# EasyEDA schematic SmartBinDiagram.json
TITLE: SmartBin; REV: 1.0; Date: 2024-05-15; Sheet: 1/1; Drawn By: stevenleonel22201; Company: Leonel Campos
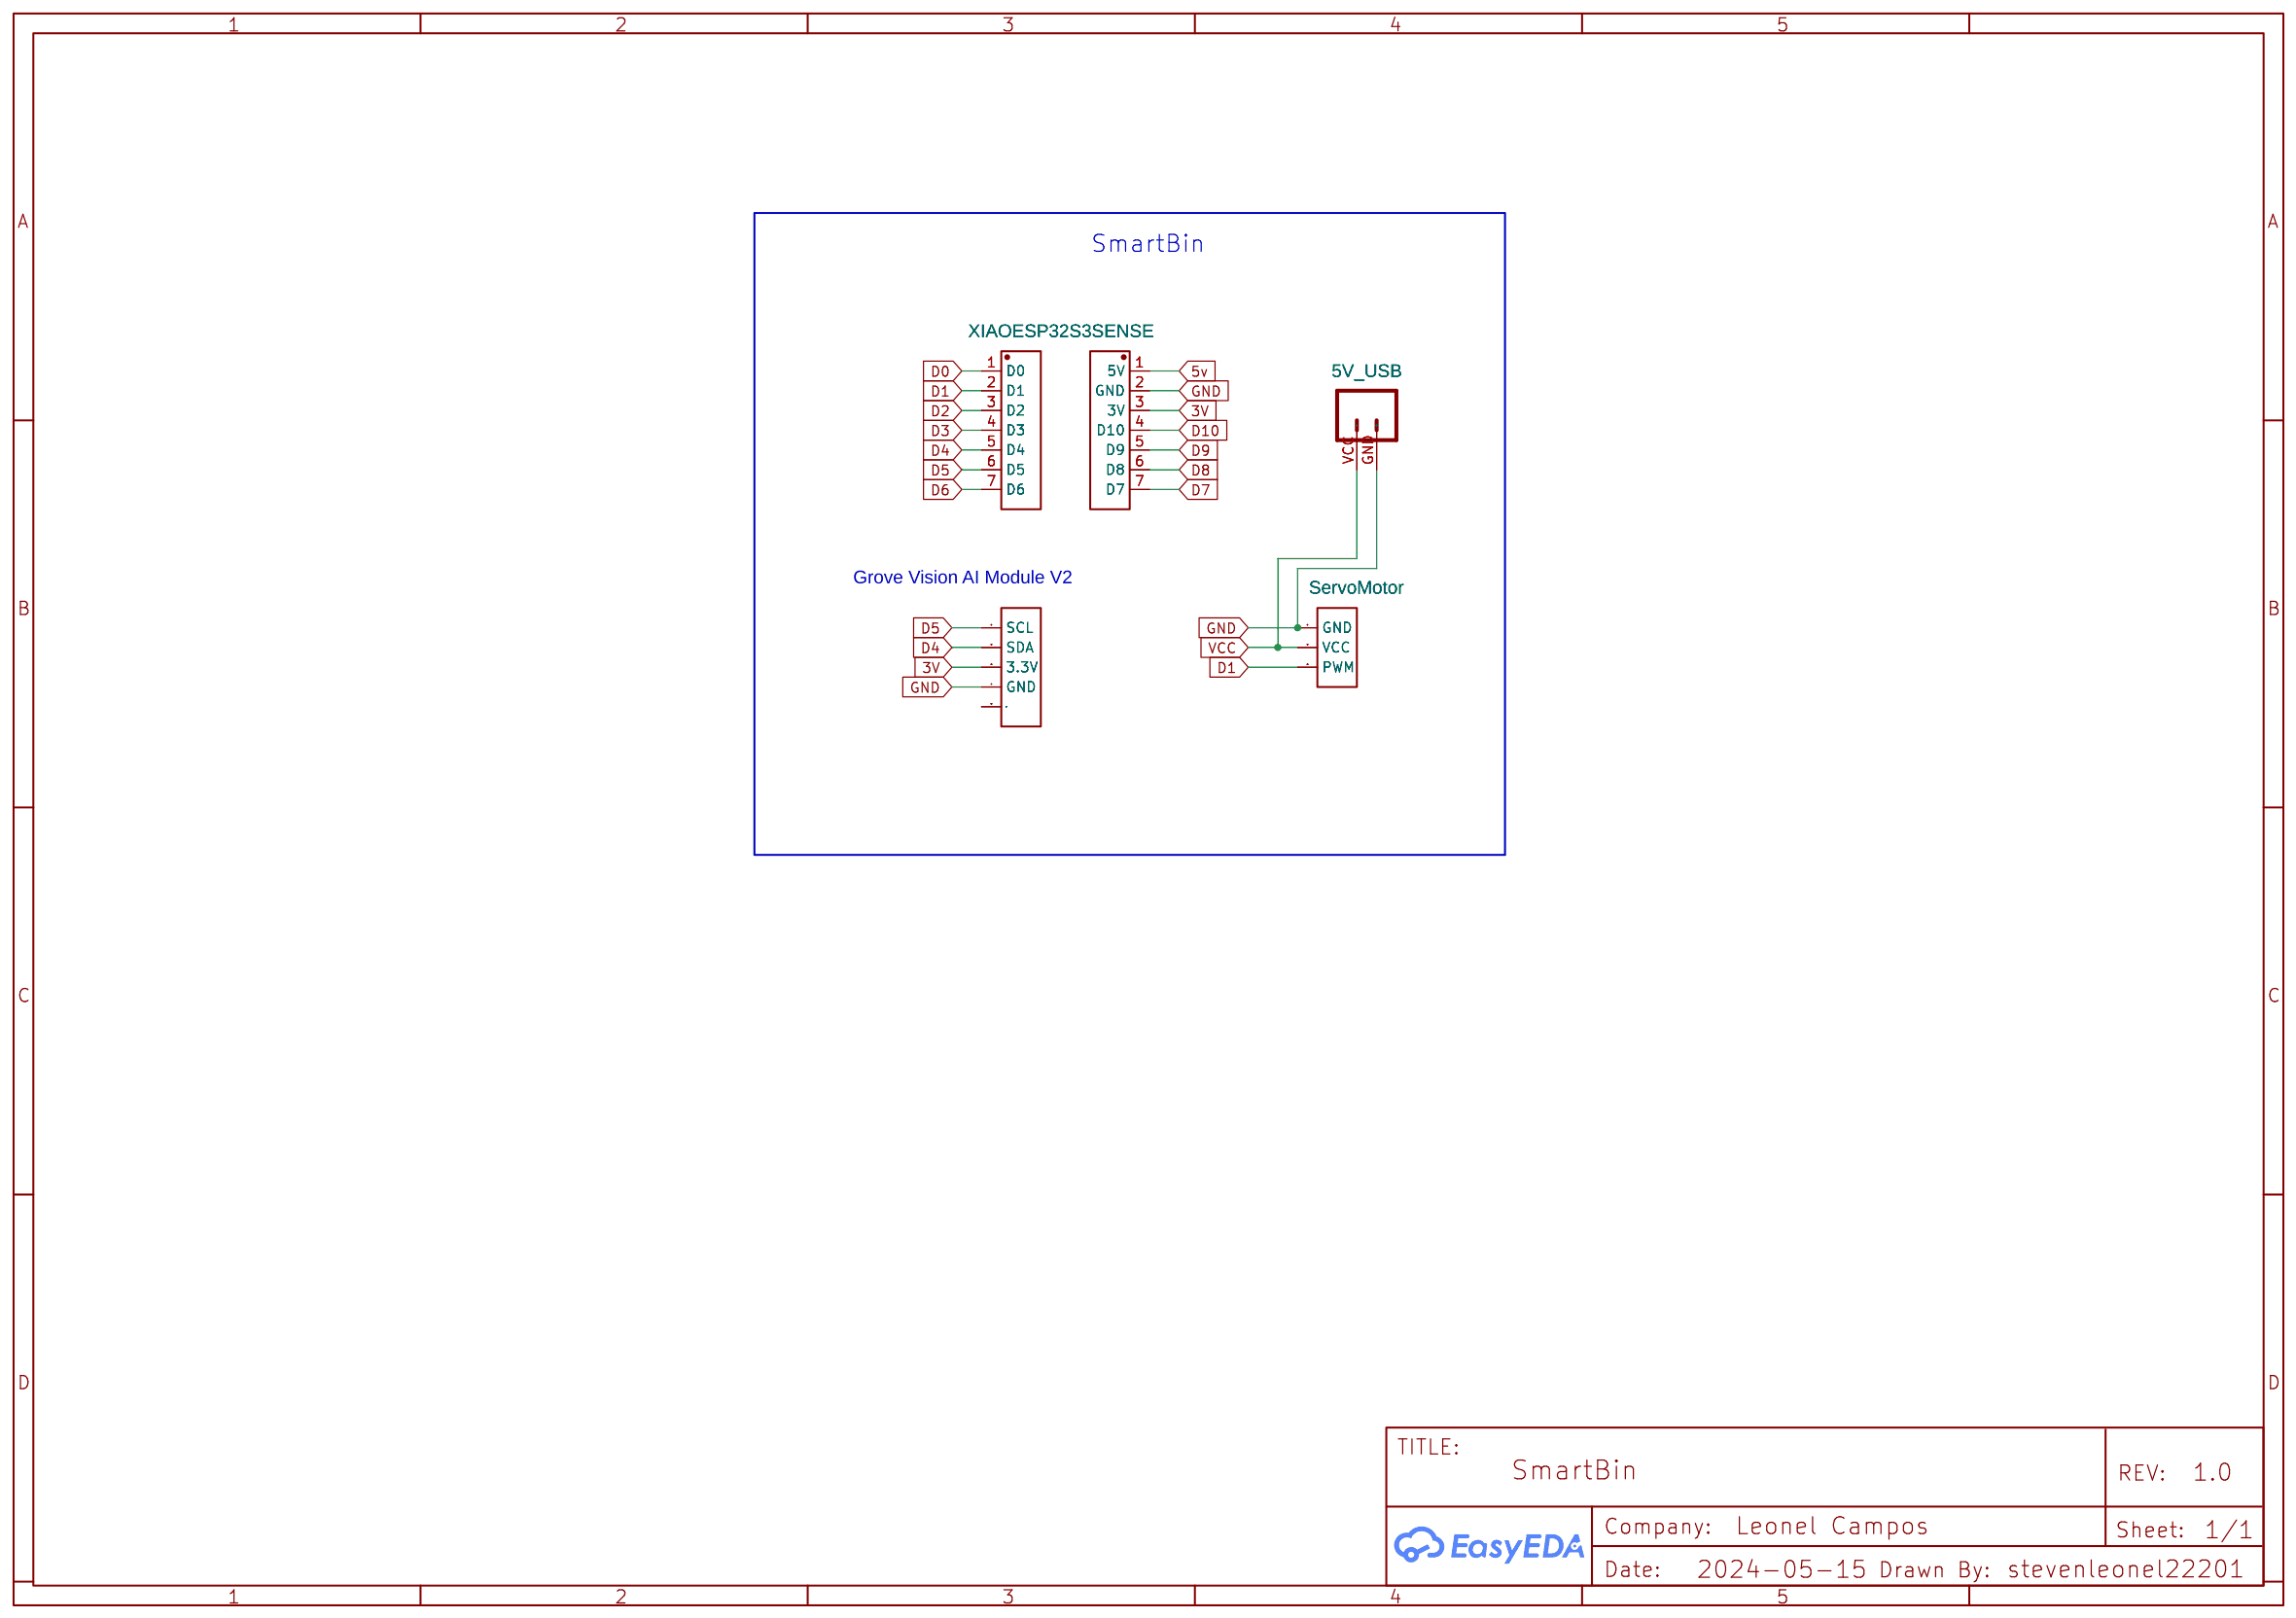
[diagram p0: schematic sheet]

## Parts
5V_USB  NO  [SCREWTERMINAL-5MM-2]
G1  Header-Female-2.54_1x5  [HDR-TH_5P-P2.54-V-F]
P2  ServoMotor  [HDR-TH_3P-P2.54-V-F]
XIAOESP32S3SENSE  PIN HEADER - 1X7  [HEADER - HEADER-FEMALE-2.54_1X7]
XIAOL1  PIN HEADER - 1X7  [HEADER - HEADER-FEMALE-2.54_1X7]

## Library data of the parts
5V_USB = M025MM: Standard 2-pin 0.1 header. Use with; Contributor: SparkFun
G1 = Header-Female-2.54_1x5: Supplier: LCSC; Manufacturer: BOOMELE(博穆精密); Manufacturer Part: 2.54-1*5P母; Supplier Part: C50950; JLCPCB Part Class: Extended Part; link: https://lcsc.com/eda_search?q=C50950&%26type=1&ref=editor
P2 = Header-Female-2.54_1x3: Supplier Part: C146243; Supplier: LCSC; Manufacturer: BOOMELE(博穆精密); Manufacturer Part: 2.54-1*3P母; JLCPCB Part Class: Extended Part; link: https://lcsc.com/eda_search?q=C146243&%26type=1&ref=editor
XIAOESP32S3SENSE XIAOL1 = PIN HEADER - 1X7: Contributor: Harald Bregu

## Nets
3V: G1.3(3.3V) XIAOESP32S3SENSE.3(3V)
5v: XIAOESP32S3SENSE.1(5V)
GND: 5V_USB.GND(2) G1.4(GND) P2.1(GND) XIAOESP32S3SENSE.2(GND)
VCC: 5V_USB.VCC(1) P2.2(VCC)
D0: XIAOL1.1(D0)
D1: P2.3(PWM) XIAOL1.2(D1)
D2: XIAOL1.3(D2)
D3: XIAOL1.4(D3)
D4: G1.2(SDA) XIAOL1.5(D4)
D5: G1.1(SCL) XIAOL1.6(D5)
D6: XIAOL1.7(D6)
D7: XIAOESP32S3SENSE.7(D7)
D8: XIAOESP32S3SENSE.6(D8)
D9: XIAOESP32S3SENSE.5(D9)
D10: XIAOESP32S3SENSE.4(D10)

Not connected (* = marked no-connect by the designer): G1 5

## Notes on the sheet
- SmartBin
- Grove Vision AI Module V2
